# Altium schematic sheet Meriem_Eliot_IMU.SchDoc
size A4; SheetNumber: 1; SheetTotal: 1
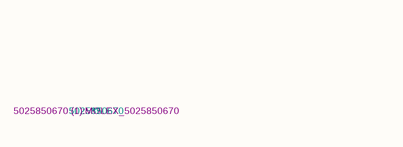
[diagram p0: Meriem_Eliot_IMU.SchDoc, left]
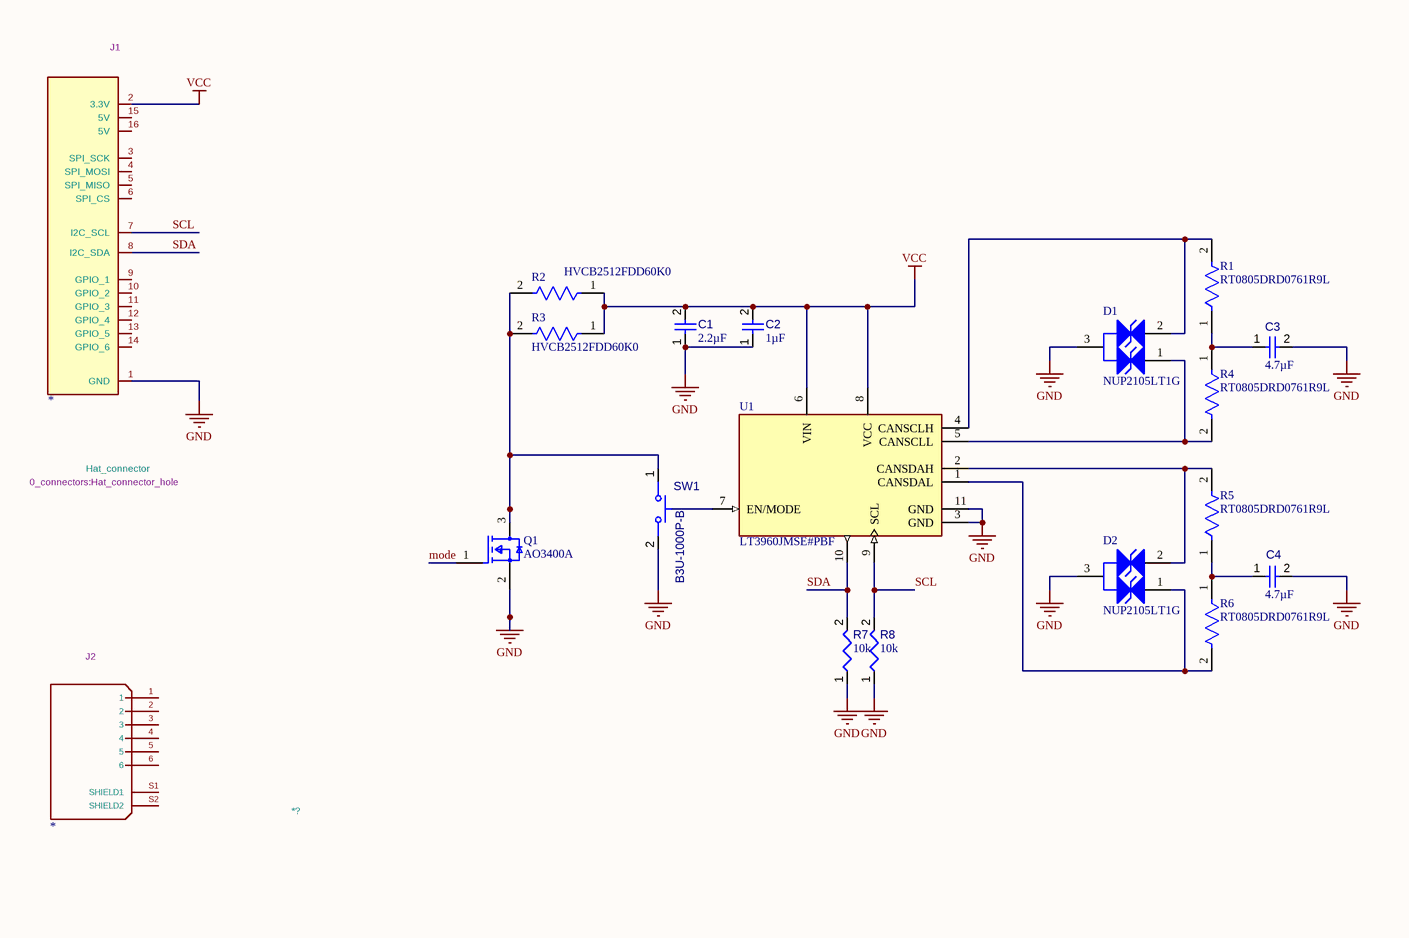
[diagram p1: Meriem_Eliot_IMU.SchDoc, right]

## Parts
(Parts that share a designator on the sheet are numbered #1, #2 ... from top to bottom, then left to right.)
*?#1  *  value Hat_connector  Reference: J1  Footprint: 0_connectors:Hat_connector_hole
*?#2  *  value 5025850670  Reference: J2  Footprint: 5025850670 (1):MOLEX_5025850670
C1  value 2.2µF  [CAPC0402(1005)60_L]  (hidden comment: Capacitor 2,2µF +/-20% 10V 0402)
C2  value 1µF  [CAPC2013X145X50ML20T25]  (hidden comment: Capacitor 1 uF +/- 10% 25 V 0805)
C3  value 4.7µF  [CAPC0603(1608)100_L]  (hidden comment: Capacitor 4.7µF +/-20% 10V 0603)
C4  value 4.7µF  [CAPC0603(1608)100_L]  (hidden comment: Capacitor 4.7µF +/-20% 10V 0603)
D1  NUP2105LT1G  [ONSC-SOT-23-3-318-08_V]
D2  NUP2105LT1G  [ONSC-SOT-23-3-318-08_V]
Q1  AO3400A  [FP-SOT23-MFG]
R1  RT0805DRD0761R9L  [FP-RT0805-MFG]
R2  HVCB2512FDD60K0  [FP-HVCB2512-MFG]
R3  HVCB2512FDD60K0  [FP-HVCB2512-MFG]
R4  RT0805DRD0761R9L  [FP-RT0805-MFG]
R5  RT0805DRD0761R9L  [FP-RT0805-MFG]
R6  RT0805DRD0761R9L  [FP-RT0805-MFG]
R7  value 10k  [RESC0402(1005)_L]  (hidden comment: Resistor 10K  +/-1 % 0402 63 mW)
R8  value 10k  [RESC0402(1005)_L]  (hidden comment: Resistor 10K  +/-1 % 0402 63 mW)
SW1  B3U-1000P-B  [OMRON-B3U-1000P-2-B_V]
U1  LT3960JMSE#PBF  [FP-MSE-10-05-08-1664-IPC_C]

## Nets
GND: *?#1.1(GND) C1.1 C2.1 C3.2 C4.2 D1.3(K) D2.3(K) Q1.2(S) R7.1 R8.1 SW1.2 U1.3(GND) U1.11(GND)
VCC: *?#1.2(3.3V) C1.2 C2.2 R2.1 R3.1 U1.6(VIN) U1.8(VCC)
mode: Q1.1(G)
SCL: *?#1.7(I2C_SCL) R8.2 U1.9(SCL)
SDA: *?#1.8(I2C_SDA) R7.2 U1.10(SDA)
NetC3_1: C3.1 R1.1 R4.1
NetC4_1: C4.1 R5.1 R6.1
NetD1_1: D1.1(K) R4.2 U1.5(CANSCLL)
NetD1_2: D1.2(K) R1.2 U1.4(CANSCLH)
NetD2_1: D2.1(K) R6.2 U1.1(CANSDAL)
NetD2_2: D2.2(K) R5.2 U1.2(CANSDAH)
NetQ1_3: Q1.3(D) R2.2 R3.2 SW1.1

Not connected (* = marked no-connect by the designer): *?#1 3(SPI_SCK) 4(SPI_MOSI) 5(SPI_MISO) 6(SPI_CS) 9(GPIO_1) 10(GPIO_2) 11(GPIO_3) 12(GPIO_4) 13(GPIO_5) 14(GPIO_6) 15(5V) 16(5V); *?#2 1 2 3 4 5 6 S1(SHIELD1) S2(SHIELD2); U1 7(EN/MODE)

## Library data of the parts
*?#1 = Hat_connector_1
*?#2 = 5025850670: MANUFACTURER: Molex; MF: MOLEX / WALDOM; MP: 502585-0670; MAXIMUM_PACKAGE_HEIGHT: 6.4 mm; Package: None; Price: None; Check_prices: https://www.snapeda.com/parts/502585-0670/Molex+%252F+Waldom/view-part/?ref=eda; STANDARD: Manufacturer Recommendations; PARTREV: C; SnapEDA_Link: https://www.snapeda.com/parts/502585-0670/Molex+%252F+Waldom/view-part/?ref=snap; Purchase-URL: https://www.snapeda.com/api/url_track_click_mouser/?unipart_id=6298183&manufacturer=MOLEX / WALDOM&part_name=502585-0670&search_term=None; Availability: In Stock
C1 = CMP-001-00056-4: Chip Capacitor, 2,2µF +/-20%, 10V, 0402, Thickness 0.6 mm; Tolerance: 10%; Mounting Technology: SMT; Max Operating Temperature: 85°C; Case/Package: 0402; Pins: 2; Min Operating Temperature: -55°C; Voltage Rating: 10V
C2 = CMP-001-00010-6: Chip Capacitor, 1 uF, +/-10%, 25 V, 0805 (2012 Metric); Capacitor Type: Ceramic; Voltage Rating: 25V; RoHS Compliant: True; Pins: 2; Mounting Technology: SM; Max Operating Temperature: 125°C; Min Operating Temperature: -55°C; Tolerance: 10%; Case/Package: 0805
C3 C4 = CMP-001-00076-4: Chip Capacitor, 4.7µF +/-20%, 10V, 0603, Thickness 1 mm; Tolerance: 10%; Mounting Technology: SMT; Case/Package: 0603; Pins: 2; Min Operating Temperature: -55°C; Max Operating Temperature: 85°C; Voltage Rating: 10V
D1 D2 = CMP-1063-00164-1: Dual Line CAN Bus Protector, 3-Pin SOT-23, Pb-Free, Tape and Reel; Manufacturer: On Semiconductor; IR Max (uA): 0.1; Number of Lines: 2; Direction: Bidirectional; C Max (pF): 30; PPK Max (W): 350; V(BR) Min (V): 26.2; ComponentLink3URL: http://www.onsemi.cn/pub_link/Collateral/318-08.PDF; Mounting Technology: Surface Mount; ComponentLink2Description: Datasheet; PartNumber: NUP2105LT1G; ComponentLink1URL: http://www.onsemi.com/; PackageVersion: Rev. AP, 11/2009; DatasheetVersion: Rev. 5; RoHS: Pb-Free; PackageReference: SOT-23-3-318-08; ComponentLink2URL: http://www.onsemi.cn/pub_link/Collateral/NUP2105L-D.PDF; ComponentLink1Description: Manufacturer URL; PackageDescription: 3-Pin Small Outline Transistor, Body 2.92 x 1.3 mm, Pitch 0.95 mm; Packing: Tape and Reel; ComponentLink3Description: Package Specification
Q1 = CMP-83955-000006-1: MOSFET N-CH 30V 5.7A SOT23; Input Capacitance: 630pF; Number of Elements: 1; Rds On Max: 26.5mR; Max Power Dissipation: 1.4W; Gate to Source Voltage (Vgs): 12V; Min Operating Temperature: -55°C; Lead Free: Lead Free; Number of Pins: 3; Drain to Source Voltage (Vdss): 30V; Case/Package: SOT-23; Mount: Surface Mount; Continuous Drain Current (ID): 5.7A; Radiation Hardening: No; Packaging: Tape and Reel; Max Operating Temperature: 150°C; Power Dissipation: 1.4W
R1 R4-R6 = CMP-03412-012957-1: RES SMD 61.9 OHM 0.5% 1/8W 0805; Manufacturer: Yageo; Value: 61.9Ω; Power Rating: 0.125W; Voltage Rating: 150V; Temperature Coefficient: 25 ppm/°C; Tolerance: 0.01; Device Class L2: Resistors; Category: Res; Digikey Description: RES SMD 61.9 OHM 0.5% 1/8W 0805; Temperature: -55°C to +155°C; Height: 0.6mm; Manufacturer Part Number: RT0805DRD0761R9L; ComponentLink2Description: Datasheet; ComponentLink2URL: http://www.yageo.com/documents/recent/PYu-RT_1-to-0.01_RoHS_L_9.pdf; Composition: Thin Film; Resistance: 61.9Ω; Temperature Range High: +155°C; Package: RT0805; Lead Free: Yes; Device Class L3: Chip SMD Resistors; Ipc Land Pattern Name: RESC200125X50; Device Class L1: Passive Components; Series: RT; Octopart: https://octopart.com/rt0805drd0761r9l-yageo-1450683; Footprint Url: http://www.yageo.com/exep/pages/download/literatures/PYu-R_Mount_10.pdf; RoHS: TRUE; Temperature Range Low: -55°C; Automotive: No
R2 R3 = CMP-00347-19883688-2: HVCB2512FDD60K0 Res Thick Film 2512 60K Ohm 1% 2W ±100ppm/°C Molded SMD Plastic T/R; Voltage Rating: 3kV; Resistance: 60kΩ; Number of Terminations: 2; Case/Package: 2512; Height: 760µm; Width: 3.175mm; Min Operating Temperature: -55°C; Case Code (Imperial): 2512; Composition: Thick Film; Max Operating Temperature: 150°C; NexarPartId: 19883688; Length: 6.35mm; Case Code (Metric): 6432; Packaging: Digi-Reel®; Power Rating: 2W; Mount: Surface Mount; Max Power Dissipation: 2W; Temperature Coefficient: 100ppm/°C; Tolerance: 1%; RoHS: Compliant
R7 R8 = CMP-009-00149-3: Chip Resistor, 10 kOhms, +/-1 %, 63 mW, -55 to 125 degC, 0402; Power: 63mW; Tolerance: 1%; Min Operating Temperature: -55°C; Case/Package: 0402; Max Operating Temperature: 155°C; Pins: 2
SW1 = CMP-011-00011-3: Ultra-small Surface-mounting Tactile Switches with High Contact Reliability, SPST-NO, -25 to 70 degC, 2-Pin SMD, RoHS, Tape and Reel; Voltage Rating: 12V; Current Rating: 50mA; Pins: 2; RoHS Compliant: Details
U1 = CMP-09093-000180-1: IC TRANSCEIVER FULL 1/1 10MSOP; RoHS Compliant: Yes